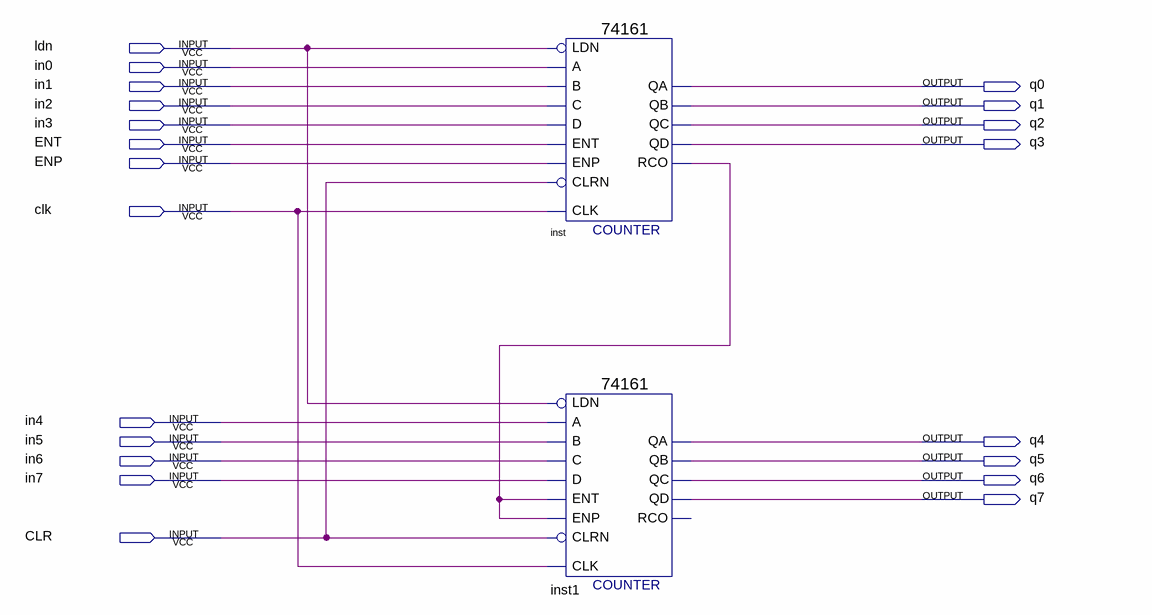
[diagram p0: schematic sheet]
// Quartus schematic pc.bdf as structural Verilog: 2 symbols, 21 pins
module pc (
  input  ldn,
  input  in0,
  input  in1,
  input  in2,
  input  in3,
  input  ENT,
  input  ENP,
  input  clk,
  input  in4,
  input  in5,
  input  in6,
  input  in7,
  input  CLR,
  output q0,
  output q1,
  output q2,
  output q3,
  output q4,
  output q5,
  output q6,
  output q7
);

  wire inst_rco;

  \74161  inst (
    .CLRN(CLR), .CLK(clk), .ENP(ENP), .LDN(ldn), .A(in0), .D(in3), .ENT(ENT), .B(in1), .C(in2), .QD(q3),
    .QC(q2), .QB(q1), .QA(q0), .RCO(inst_rco));
  \74161  inst1 (
    .CLRN(CLR), .CLK(clk), .ENP(inst_rco), .LDN(ldn), .A(in4), .D(in7), .ENT(inst_rco), .B(in5), .C(in6),
    .QD(q7), .QC(q6), .QB(q5), .QA(q4));  // open: RCO
endmodule
